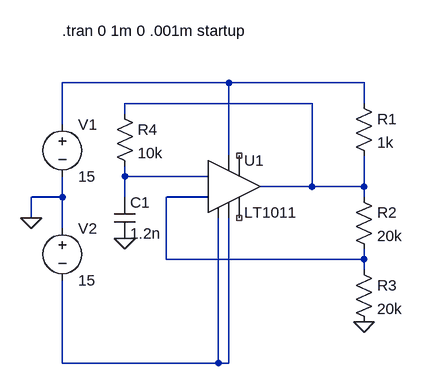
[diagram p0: schematic comparadorLt1011_3.asc]
comparadorLt1011_3.asc, the LTspice schematic file:
Version 4
SHEET 1 1044 680
WIRE 192 0 -64 0
WIRE 400 0 192 0
WIRE 320 32 32 32
WIRE 400 32 400 0
WIRE 32 48 32 32
WIRE -64 64 -64 0
WIRE 192 112 192 0
WIRE 32 144 32 128
WIRE 160 144 32 144
WIRE 320 160 320 32
WIRE 320 160 240 160
WIRE 400 160 400 112
WIRE 400 160 320 160
WIRE -64 176 -64 144
WIRE -64 176 -112 176
WIRE 32 176 32 144
WIRE 160 176 96 176
WIRE 400 176 400 160
WIRE -112 208 -112 176
WIRE -64 224 -64 176
WIRE 96 272 96 176
WIRE 400 272 400 256
WIRE 400 272 96 272
WIRE 400 288 400 272
WIRE -64 432 -64 304
WIRE 176 432 176 208
WIRE 176 432 -64 432
WIRE 192 432 192 208
WIRE 192 432 176 432
FLAG -112 208 0
FLAG 32 240 0
FLAG 400 368 0
SYMBOL Comparators\\LT1011 192 160 R0
SYMATTR InstName U1
SYMBOL voltage -64 48 R0
WINDOW 123 0 0 Left 0
WINDOW 39 0 0 Left 0
SYMATTR InstName V1
SYMATTR Value 15
SYMBOL voltage -64 208 R0
WINDOW 123 0 0 Left 0
WINDOW 39 0 0 Left 0
SYMATTR InstName V2
SYMATTR Value 15
SYMBOL res 384 16 R0
SYMATTR InstName R1
SYMATTR Value 1k
SYMBOL res 384 160 R0
SYMATTR InstName R2
SYMATTR Value 20k
SYMBOL res 384 272 R0
SYMATTR InstName R3
SYMATTR Value 20k
SYMBOL cap 16 176 R0
SYMATTR InstName C1
SYMATTR Value 1.2n
SYMBOL res 16 32 R0
SYMATTR InstName R4
SYMATTR Value 10k
TEXT -64 -80 Left 2 !.tran 0 1m 0 .001m startup

The netlist it stands for:
* comparadorLt1011_3.asc
XU1 N005 N004 N003 N005 NC_01 NC_02 N002 N001 LT1011
V1 N001 0 15
V2 0 N005 15
R1 N001 N002 1k
R2 N002 N004 20k
R3 N004 0 20k
C1 N003 0 1.2n
R4 N002 N003 10k
.tran 0 1m 0 .001m startup
.lib LTC1.lib
.backanno
.end